# Altium schematic sheet Motherboard.SchDoc
size A4; SheetNumber: 1; SheetTotal: 7
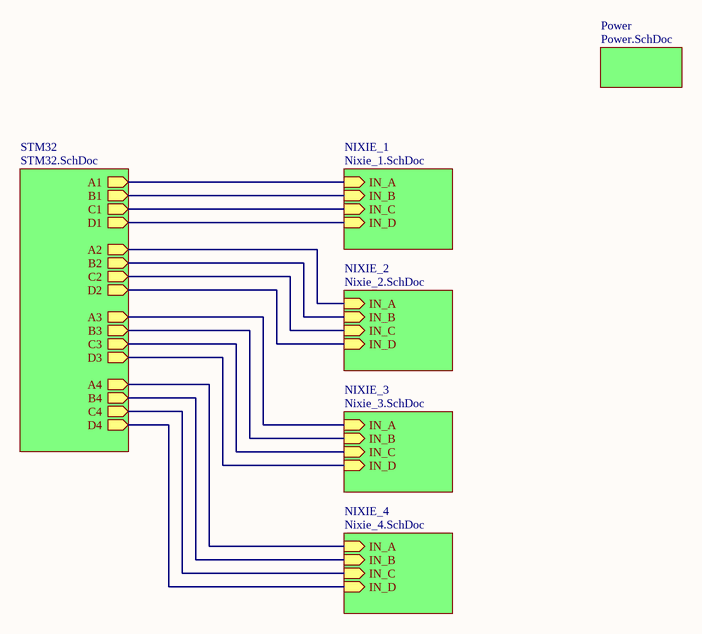
[diagram p0: Motherboard.SchDoc]

## Sub-sheets
NIXIE_1 = Nixie_1.SchDoc: IN_A (in), IN_B (in), IN_C (in), IN_D (in)
NIXIE_2 = Nixie_2.SchDoc: IN_A (in), IN_B (in), IN_C (in), IN_D (in)
NIXIE_3 = Nixie_3.SchDoc: IN_A (in), IN_B (in), IN_C (in), IN_D (in)
NIXIE_4 = Nixie_4.SchDoc: IN_A (in), IN_B (in), IN_C (in), IN_D (in)
Power = Power.SchDoc: no entries
STM32 = STM32.SchDoc: A1 (out), B1 (out), C1 (out), D1 (out), A2 (out), B2 (out), C2 (out), D2 (out), A3 (out), B3 (out), C3 (out), D3 (out), A4 (out), B4 (out), C4 (out), D4 (out)

## Nets
(unnamed): sheet NIXIE_1/IN_A, sheet STM32/A1
(unnamed): sheet NIXIE_1/IN_B, sheet STM32/B1
(unnamed): sheet NIXIE_1/IN_C, sheet STM32/C1
(unnamed): sheet NIXIE_1/IN_D, sheet STM32/D1
(unnamed): sheet NIXIE_2/IN_A, sheet STM32/A2
(unnamed): sheet NIXIE_2/IN_B, sheet STM32/B2
(unnamed): sheet NIXIE_2/IN_C, sheet STM32/C2
(unnamed): sheet NIXIE_2/IN_D, sheet STM32/D2
(unnamed): sheet NIXIE_3/IN_A, sheet STM32/A3
(unnamed): sheet NIXIE_3/IN_B, sheet STM32/B3
(unnamed): sheet NIXIE_3/IN_C, sheet STM32/C3
(unnamed): sheet NIXIE_3/IN_D, sheet STM32/D3
(unnamed): sheet NIXIE_4/IN_A, sheet STM32/A4
(unnamed): sheet NIXIE_4/IN_B, sheet STM32/B4
(unnamed): sheet NIXIE_4/IN_C, sheet STM32/C4
(unnamed): sheet NIXIE_4/IN_D, sheet STM32/D4